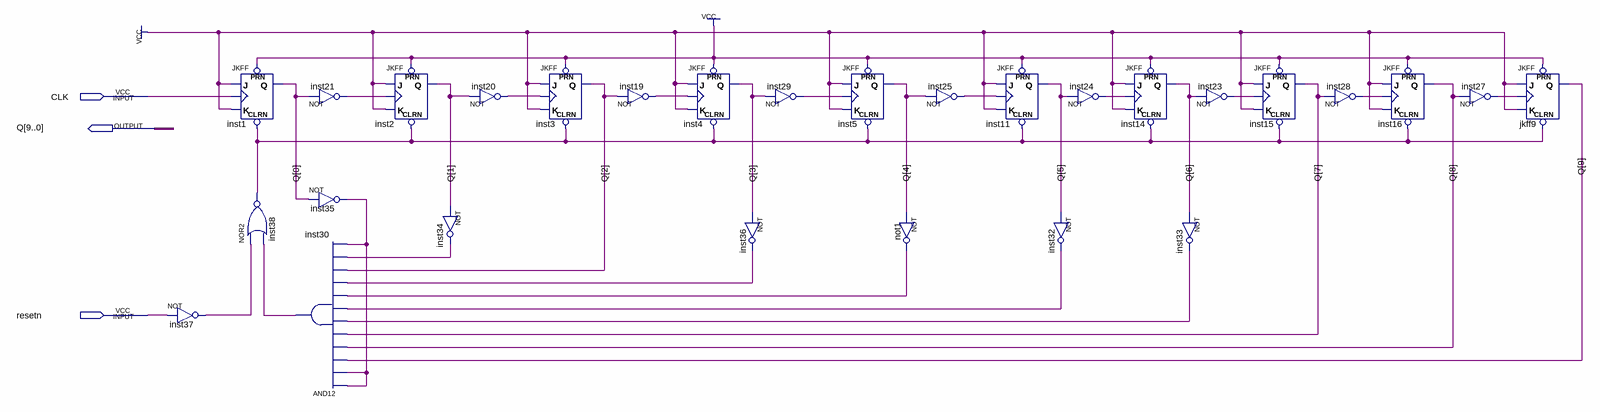
[diagram p0: schematic sheet]
// Quartus schematic Counter_10b.bdf as structural Verilog: 28 symbols, 3 pins
module Counter_10b (
  input  CLK,
  input  resetn,
  output [9:0] Q
);

  wire inst19_out, inst20_out, inst21_out, inst23_out, inst24_out, inst25_out, inst27_out, inst28_out,
       inst29_out, inst30_out, inst32_out, inst33_out, inst34_out, inst35_out, inst36_out, inst37_out,
       inst38_out, not1_out;

  not inst37 (inst37_out, resetn);
  JKFF inst1 (.PRN(1'b1), .CLRN(inst38_out), .K(1'b1), .J(1'b1), .CLK(CLK), .Q(Q[0]));
  nor inst38 (inst38_out, inst37_out, inst30_out);
  not inst21 (inst21_out, Q[0]);
  not inst35 (inst35_out, Q[0]);
  and inst30 (inst30_out, inst35_out, inst35_out, Q[9], Q[8], Q[7], inst33_out, inst32_out, not1_out, inst36_out, Q[2], inst34_out, inst35_out);
  JKFF inst2 (.PRN(1'b1), .CLRN(inst38_out), .K(1'b1), .J(1'b1), .CLK(inst21_out), .Q(Q[1]));
  not inst20 (inst20_out, Q[1]);
  not inst34 (inst34_out, Q[1]);
  JKFF inst3 (.PRN(1'b1), .CLRN(inst38_out), .K(1'b1), .J(1'b1), .CLK(inst20_out), .Q(Q[2]));
  not inst19 (inst19_out, Q[2]);
  JKFF inst4 (.PRN(1'b1), .CLRN(inst38_out), .K(1'b1), .J(1'b1), .CLK(inst19_out), .Q(Q[3]));
  not inst29 (inst29_out, Q[3]);
  not inst36 (inst36_out, Q[3]);
  JKFF inst5 (.PRN(1'b1), .CLRN(inst38_out), .K(1'b1), .J(1'b1), .CLK(inst29_out), .Q(Q[4]));
  not inst25 (inst25_out, Q[4]);
  not not1 (not1_out, Q[4]);
  JKFF inst11 (.PRN(1'b1), .CLRN(inst38_out), .K(1'b1), .J(1'b1), .CLK(inst25_out), .Q(Q[5]));
  not inst24 (inst24_out, Q[5]);
  not inst32 (inst32_out, Q[5]);
  JKFF inst14 (.PRN(1'b1), .CLRN(inst38_out), .K(1'b1), .J(1'b1), .CLK(inst24_out), .Q(Q[6]));
  not inst23 (inst23_out, Q[6]);
  not inst33 (inst33_out, Q[6]);
  JKFF inst15 (.PRN(1'b1), .CLRN(inst38_out), .K(1'b1), .J(1'b1), .CLK(inst23_out), .Q(Q[7]));
  not inst28 (inst28_out, Q[7]);
  JKFF inst16 (.PRN(1'b1), .CLRN(inst38_out), .K(1'b1), .J(1'b1), .CLK(inst28_out), .Q(Q[8]));
  not inst27 (inst27_out, Q[8]);
  JKFF jkff9 (.PRN(1'b1), .CLRN(inst38_out), .K(1'b1), .J(1'b1), .CLK(inst27_out), .Q(Q[9]));
endmodule
